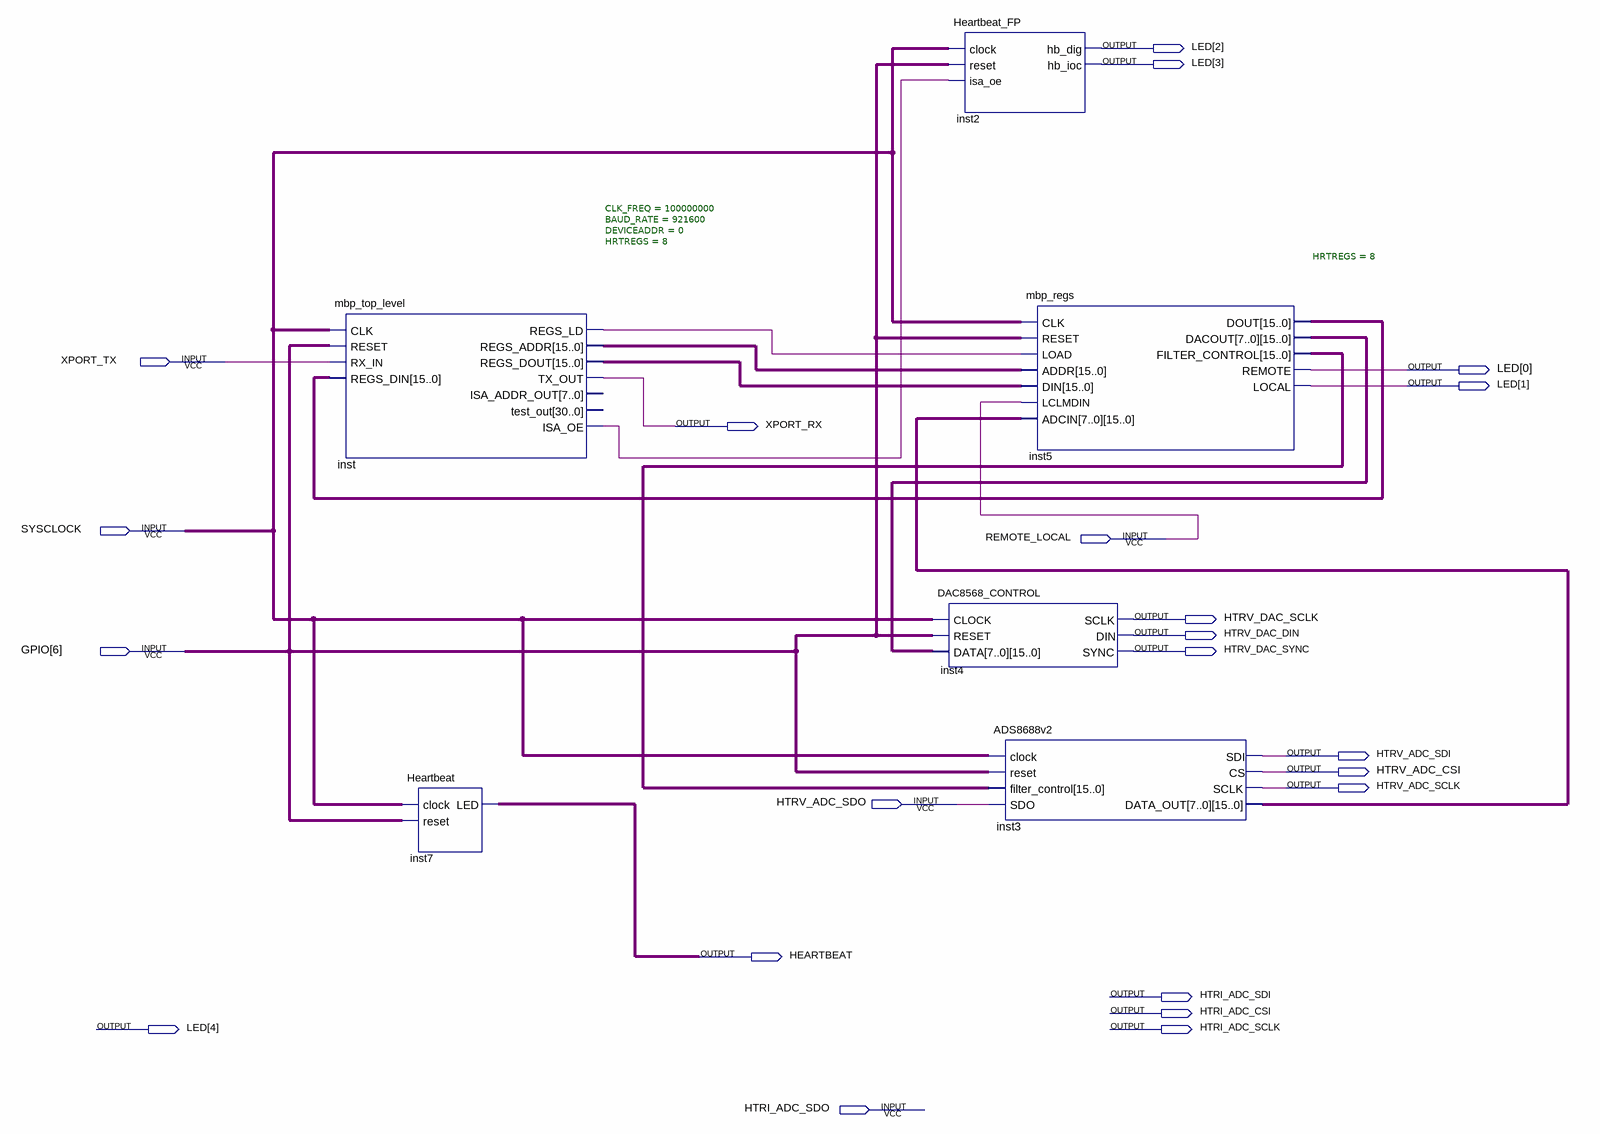
[diagram p0: schematic sheet]
// Quartus schematic MODBUS.bdf as structural Verilog: 6 symbols, 22 pins
module MODBUS (
  input  XPORT_TX,
  input  SYSCLOCK,
  input  REMOTE_LOCAL,
  input  [6:6] GPIO,
  input  HTRV_ADC_SDO,
  input  HTRI_ADC_SDO,
  output [4:0] LED,
  output XPORT_RX,
  output HTRV_DAC_SCLK,
  output HTRV_DAC_DIN,
  output HTRV_DAC_SYNC,
  output HTRV_ADC_SDI,
  output HTRV_ADC_CSI,
  output HTRV_ADC_SCLK,
  output HEARTBEAT,
  output HTRI_ADC_SDI,
  output HTRI_ADC_CSI,
  output HTRI_ADC_SCLK
);

  wire inst_isa_oe, inst_regs_ld;
  wire [15:0] inst5_dout, inst5_filter_control, inst_regs_addr, inst_regs_dout;
  wire [127:0] inst3_data_out, inst5_dacout;

  mbp_top_level #(.CLK_FREQ(100000000), .BAUD_RATE(921600), .DEVICEADDR(0), .HRTREGS(8)) inst (
    .CLK(SYSCLOCK), .RESET(GPIO[6]), .RX_IN(XPORT_TX), .REGS_DIN(inst5_dout), .REGS_LD(inst_regs_ld),
    .REGS_ADDR(inst_regs_addr), .REGS_DOUT(inst_regs_dout), .TX_OUT(XPORT_RX), .ISA_OE(inst_isa_oe));  // open: ISA_ADDR_OUT, test_out
  Heartbeat inst7 (.clock(SYSCLOCK), .reset(GPIO[6]), .LED(HEARTBEAT));
  DAC8568_CONTROL inst4 (
    .CLOCK(SYSCLOCK), .RESET(GPIO[6]), .DATA(inst5_dacout), .SCLK(HTRV_DAC_SCLK), .DIN(HTRV_DAC_DIN),
    .SYNC(HTRV_DAC_SYNC));
  Heartbeat_FP inst2 (.clock(SYSCLOCK), .reset(GPIO[6]), .isa_oe(inst_isa_oe), .hb_dig(LED[2]), .hb_ioc(LED[3]));
  ADS8688v2 inst3 (
    .clock(SYSCLOCK), .reset(GPIO[6]), .filter_control(inst5_filter_control), .SDO(HTRV_ADC_SDO),
    .SDI(HTRV_ADC_SDI), .CS(HTRV_ADC_CSI), .SCLK(HTRV_ADC_SCLK), .DATA_OUT(inst3_data_out));
  mbp_regs #(.HRTREGS(8)) inst5 (
    .CLK(SYSCLOCK), .RESET(GPIO[6]), .LOAD(inst_regs_ld), .ADDR(inst_regs_addr), .DIN(inst_regs_dout),
    .LCLMDIN(REMOTE_LOCAL), .ADCIN(inst3_data_out), .DOUT(inst5_dout), .DACOUT(inst5_dacout),
    .FILTER_CONTROL(inst5_filter_control), .REMOTE(LED[0]), .LOCAL(LED[1]));
endmodule
